# Altium schematic sheet Main.SchDoc
size A4; SheetNumber: 1; SheetTotal: 5
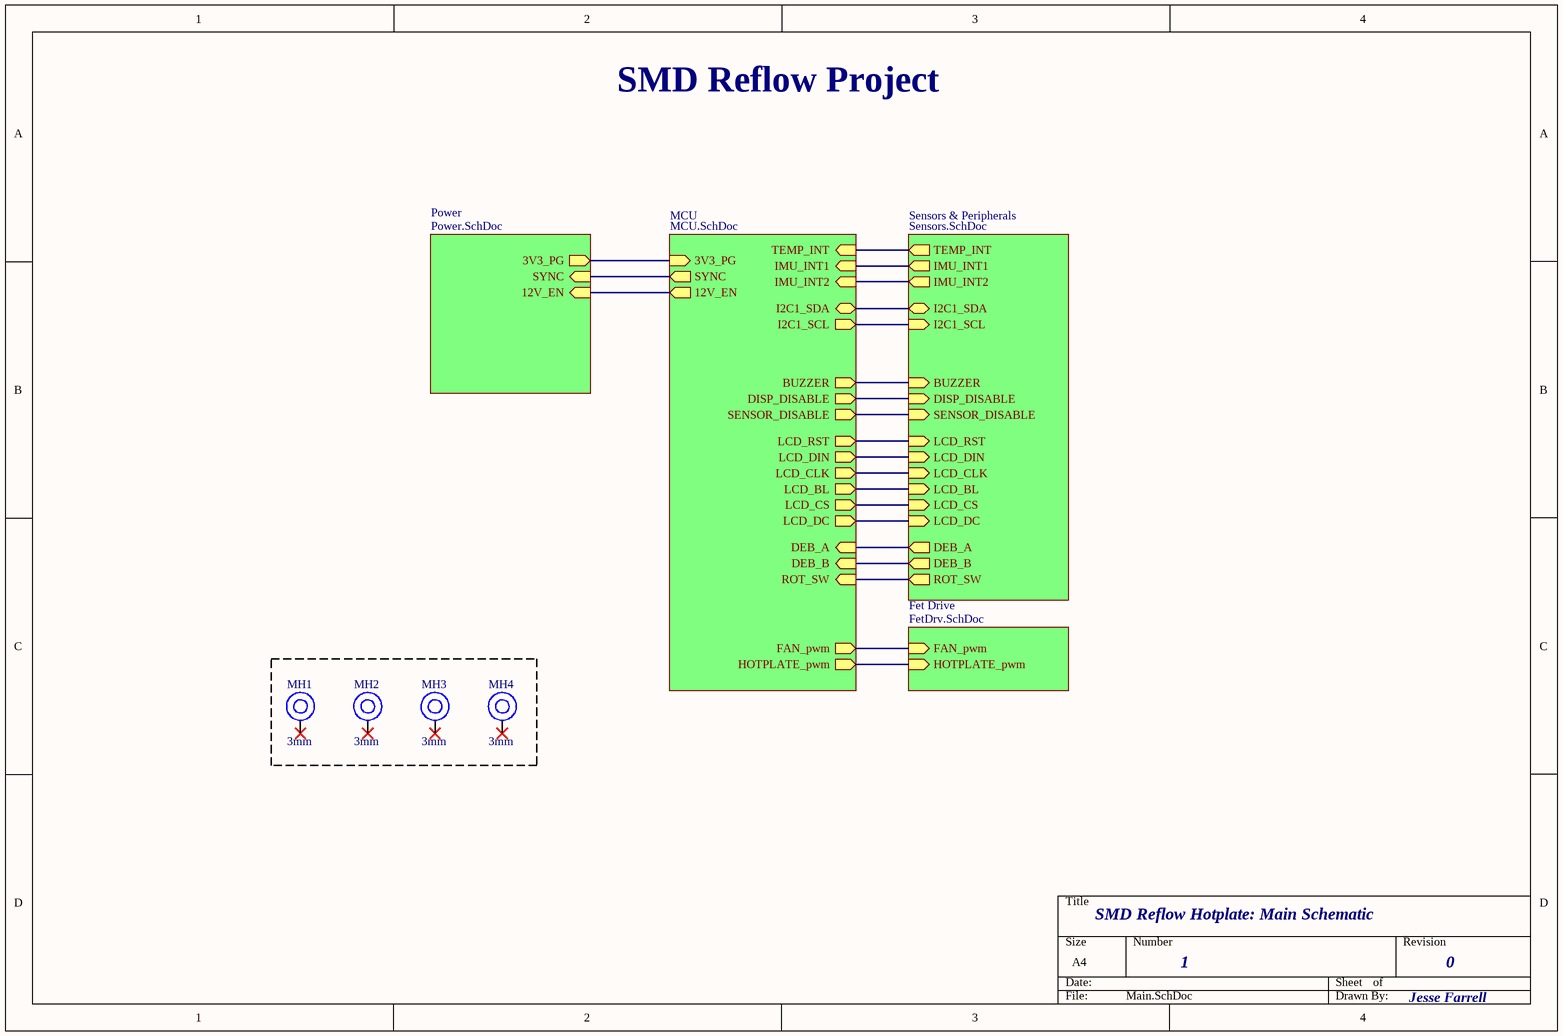
[diagram p0: Main.SchDoc]

## Parts
MH1  3mm  [Mount-Hole_3mm]
MH2  3mm  [Mount-Hole_3mm]
MH3  3mm  [Mount-Hole_3mm]
MH4  3mm  [Mount-Hole_3mm]

## Sub-sheets
Fet Drive = FetDrv.SchDoc: FAN_pwm (in), HOTPLATE_pwm (in)
MCU = MCU.SchDoc: SYNC (out), BUZZER (out), 12V_EN (out), 3V3_PG (in), TEMP_INT (in), LCD_CLK (out), LCD_CS (out), LCD_DIN (out), IMU_INT1 (in), LCD_BL (out), LCD_RST (out), LCD_DC (out), ROT_SW (in), DEB_A (in), DEB_B (in), FAN_pwm (out), HOTPLATE_pwm (out), IMU_INT2 (in), I2C1_SCL (out), DISP_DISABLE (out), SENSOR_DISABLE (out), I2C1_SDA (bidir)
Power = Power.SchDoc: 3V3_PG (out), SYNC (in), 12V_EN (in)
Sensors & Peripherals = Sensors.SchDoc: BUZZER (in), TEMP_INT (out), LCD_RST (in), LCD_DIN (in), LCD_CLK (in), LCD_BL (in), LCD_CS (in), LCD_DC (in), DEB_A (out), DEB_B (out), ROT_SW (out), IMU_INT2 (out), IMU_INT1 (out), DISP_DISABLE (in), SENSOR_DISABLE (in), I2C1_SDA (bidir), I2C1_SCL (in)

## Nets
(unnamed): sheet Power/3V3_PG, sheet MCU/3V3_PG
(unnamed): sheet Power/SYNC, sheet MCU/SYNC
(unnamed): sheet Power/12V_EN, sheet MCU/12V_EN
(unnamed): sheet MCU/BUZZER, sheet Sensors & Peripherals/BUZZER
(unnamed): sheet MCU/TEMP_INT, sheet Sensors & Peripherals/TEMP_INT
(unnamed): sheet MCU/LCD_CLK, sheet Sensors & Peripherals/LCD_CLK
(unnamed): sheet MCU/LCD_CS, sheet Sensors & Peripherals/LCD_CS
(unnamed): sheet MCU/LCD_DIN, sheet Sensors & Peripherals/LCD_DIN
(unnamed): sheet MCU/IMU_INT1, sheet Sensors & Peripherals/IMU_INT1
(unnamed): sheet MCU/LCD_BL, sheet Sensors & Peripherals/LCD_BL
(unnamed): sheet MCU/LCD_RST, sheet Sensors & Peripherals/LCD_RST
(unnamed): sheet MCU/LCD_DC, sheet Sensors & Peripherals/LCD_DC
(unnamed): sheet MCU/ROT_SW, sheet Sensors & Peripherals/ROT_SW
(unnamed): sheet MCU/DEB_A, sheet Sensors & Peripherals/DEB_A
(unnamed): sheet MCU/DEB_B, sheet Sensors & Peripherals/DEB_B
(unnamed): sheet MCU/FAN_pwm, sheet Fet Drive/FAN_pwm
(unnamed): sheet MCU/HOTPLATE_pwm, sheet Fet Drive/HOTPLATE_pwm
(unnamed): sheet MCU/IMU_INT2, sheet Sensors & Peripherals/IMU_INT2
(unnamed): sheet MCU/I2C1_SCL, sheet Sensors & Peripherals/I2C1_SCL
(unnamed): sheet MCU/DISP_DISABLE, sheet Sensors & Peripherals/DISP_DISABLE
(unnamed): sheet MCU/SENSOR_DISABLE, sheet Sensors & Peripherals/SENSOR_DISABLE
(unnamed): sheet MCU/I2C1_SDA, sheet Sensors & Peripherals/I2C1_SDA

Not connected (* = marked no-connect by the designer): MH1 1*; MH2 1*; MH3 1*; MH4 1*

## Notes on the sheet
- SMD Reflow Project
- SMD Reflow Hotplate: Main Schematic
- 1
- 0
- Jesse Farrell

## Library data of the parts
MH1-MH4 = Mount_Hole_3mm: Mounting Hole 3mm plated